# EAGLE design sensor_TEMT6000 (EAGLE 9.4.2)
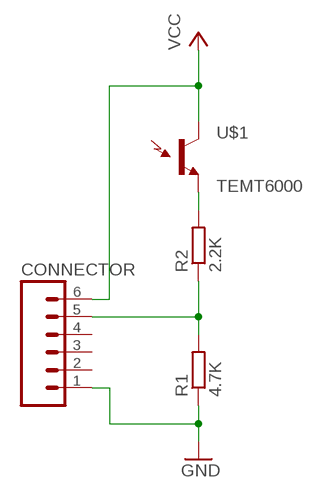
[diagram p0: schematic, sheet 1]

## Parts
CONNECTOR  M06_90SIP  [1X06_90]
R1  4.7K  R-EU_0204/7  [0204/7]
R2  2.2K  R-EU_0204/7  [0204/7]
U$1  TEMT6000  [TEMT6000-SEN]

## Nets
GND: CONNECTOR.1 R1.1
N$2: R2.2 U$1.EMITTER(E1)
SIG: CONNECTOR.5 R1.2 R2.1
VCC: CONNECTOR.6 U$1.COLLECTOR(C1)
Unconnected: CONNECTOR.2 CONNECTOR.3 CONNECTOR.4

## Library data of the parts
CONNECTOR = interfaceSARI:M06_90: Header 6 Standard 6-pin 0.1" header. Use with straight break away headers (SKU : PRT-00116), right angle break away headers (PRT-00553), swiss pins (PRT-00743), machine pins (PRT-00117), and female headers (PRT-00115). Molex polarized connector foot print use with SKU : PRT-08094 with associated crimp pins and housings. NOTES ON THE VARIANTS LOCK and LOCK_LONGPADS... This footprint was designed to help hold the alignment of a through-hole component (i.e. 6-pin header) while soldering it into place. You may notice that each hole has been shifted either up or down by 0.005 of an inch from it's more standard position (which is a perfectly straight line). This slight alteration caused the pins (the squares in the middle) to touch the edges of the holes. Because they are alternating, it causes a "brace" to hold the component in place. 0.005 has proven to be the perfect amount of "off-center" position when using our standard breakaway headers. Although looks a little odd when you look at the bare footprint, once you have a header in there, the alteration is very hard to notice. Also, if you push a header all the way into place, it is covered up entirely on the bottom side. This idea of altering the position of holes to aid alignment will be further integrated into the Sparkfun Library for other footprints. It can help hold any component with 3 or more connection pins.
R1 R2 = resistor:R-EU_: RESISTOR, European symbol
U$1 = SparkFun:TEMT6000: Ambient Light Sensor Simple light detection sensor. Output varies with light intensity input. Spark Fun Electronics SKU : COM-08348

## Board
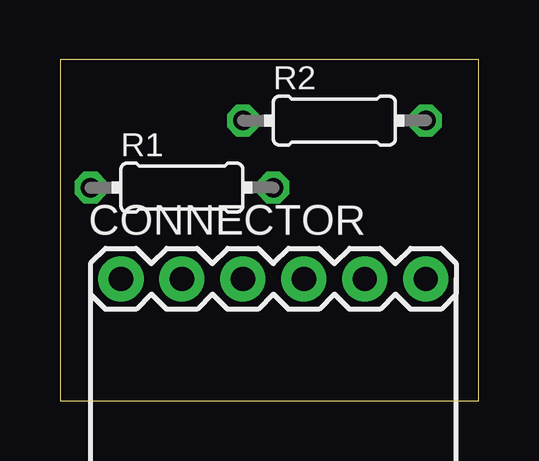
[diagram p1: board, top side]
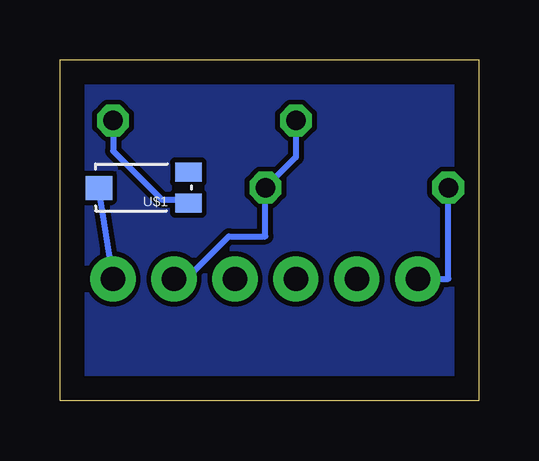
[diagram p2: board, bottom side, seen from below]

Size 17.45 x 14.21 mm. Coordinates in mm from the lower left corner, seen from the top.
Outline: 0,0 17.45,0 17.45,14.21 0,14.21 0,0
Copper layers (1*16): Top 0.035mm / dielectric 1.5mm / Bottom 0.035mm
Design rules "default": minimum track width 10mil, minimum drill 24mil, track to track 8mil, track to pad 8mil, pad to pad 8mil, via to via 8mil, smd to smd 8mil, copper to edge 40mil, drill to drill 8mil, minimum pad ring 10mil, minimum via ring 8mil, stop-mask expansion 4mil, vias tented up to drill 0mil, thermal gap 10mil

### Footprints (pad centres in the part's own frame; a part is rotated, then mirrored left to right if it is on the bottom)
1X06_90 = drill 1.016 pad 1.88: 1 0,0; 2 2.54,0; 3 5.08,0; 4 7.62,0; 5 10.16,0; 6 12.7,0
0204/7 = drill 0.813 octagon: 1 -3.81,0; 2 3.81,0
TEMT6000-SEN = smd 1.1 x 0.8: BASE -1.87,-0.65; EMITTER -1.87,0.65 | smd 1.1 x 1: COLLECTOR 1.86,0.01

### Placement (x,y rotation side)
CONNECTOR  2.54,5.08 0 top
R1  5.08,8.89 0 top
R2  11.43,11.68 0 top
U$1  13.97,8.89 180 bottom

### Tracks (layer width: path | path; a pad name or v marks a point on that pad's centre or on a via)
GND
  Bottom 0.254: R1.1 1.27,5.08 CONNECTOR.1
N$1
  pour Bottom: 0,14.22 17.53,14.22 17.27,0 0,0
N$2
  Bottom 0.254: R2.2 15.24,10.41 13.21,8.38 12.24,8.38 U$1.EMITTER
SIG
  Bottom 0.254: CONNECTOR.5 12.19,5.08 10.41,6.86 8.89,6.86 R1.2 7.62,10.16 R2.1
VCC
  Bottom 0.254: CONNECTOR.6 U$1.COLLECTOR